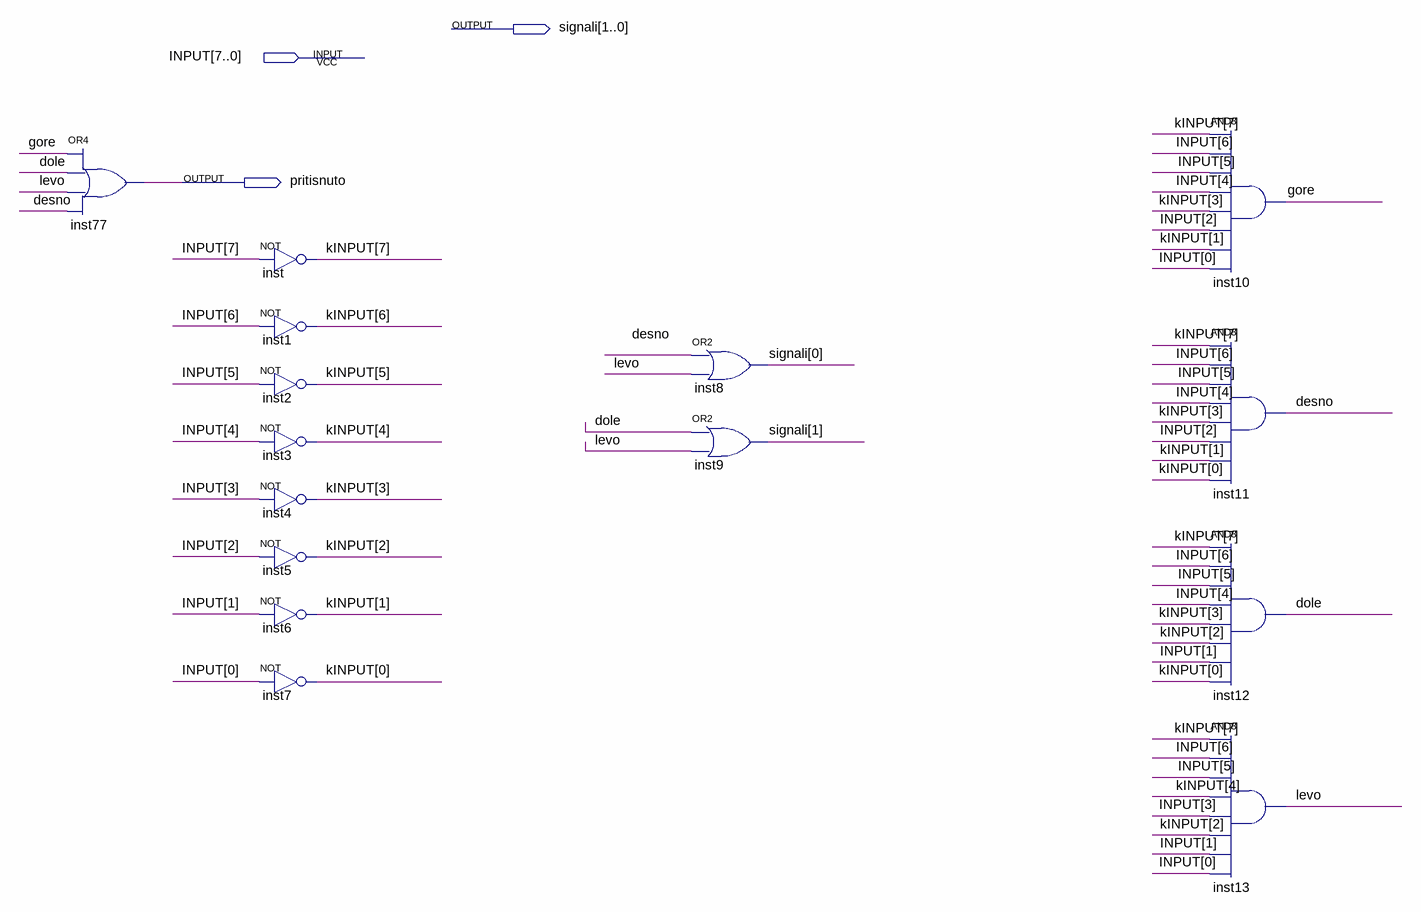
[diagram p0: schematic sheet]
// Quartus schematic strelice.bdf as structural Verilog: 15 symbols, 3 pins
module strelice (
  input  [7:0] INPUT,
  output [1:0] signali,
  output pritisnuto
);

  wire desno, dole, gore, levo;
  wire [7:0] kINPUT;

  or inst77 (pritisnuto, gore, dole, levo, desno);
  not inst (kINPUT[7], INPUT[7]);
  not inst1 (kINPUT[6], INPUT[6]);
  not inst2 (kINPUT[5], INPUT[5]);
  not inst3 (kINPUT[4], INPUT[4]);
  not inst4 (kINPUT[3], INPUT[3]);
  not inst5 (kINPUT[2], INPUT[2]);
  not inst6 (kINPUT[1], INPUT[1]);
  not inst7 (kINPUT[0], INPUT[0]);
  or inst8 (signali[0], desno, levo);
  or inst9 (signali[1], dole, levo);
  and inst10 (gore, kINPUT[7], INPUT[6], INPUT[5], INPUT[4], kINPUT[3], INPUT[2], kINPUT[1], INPUT[0]);
  and inst11 (desno, kINPUT[7], INPUT[6], INPUT[5], INPUT[4], kINPUT[3], INPUT[2], kINPUT[1], kINPUT[0]);
  and inst12 (dole, kINPUT[7], INPUT[6], INPUT[5], INPUT[4], kINPUT[3], kINPUT[2], INPUT[1], kINPUT[0]);
  and inst13 (levo, kINPUT[7], INPUT[6], INPUT[5], kINPUT[4], INPUT[3], kINPUT[2], INPUT[1], INPUT[0]);
endmodule
